# EAGLE design Motorcontroller_V0.6 (EAGLE 7.4.0)
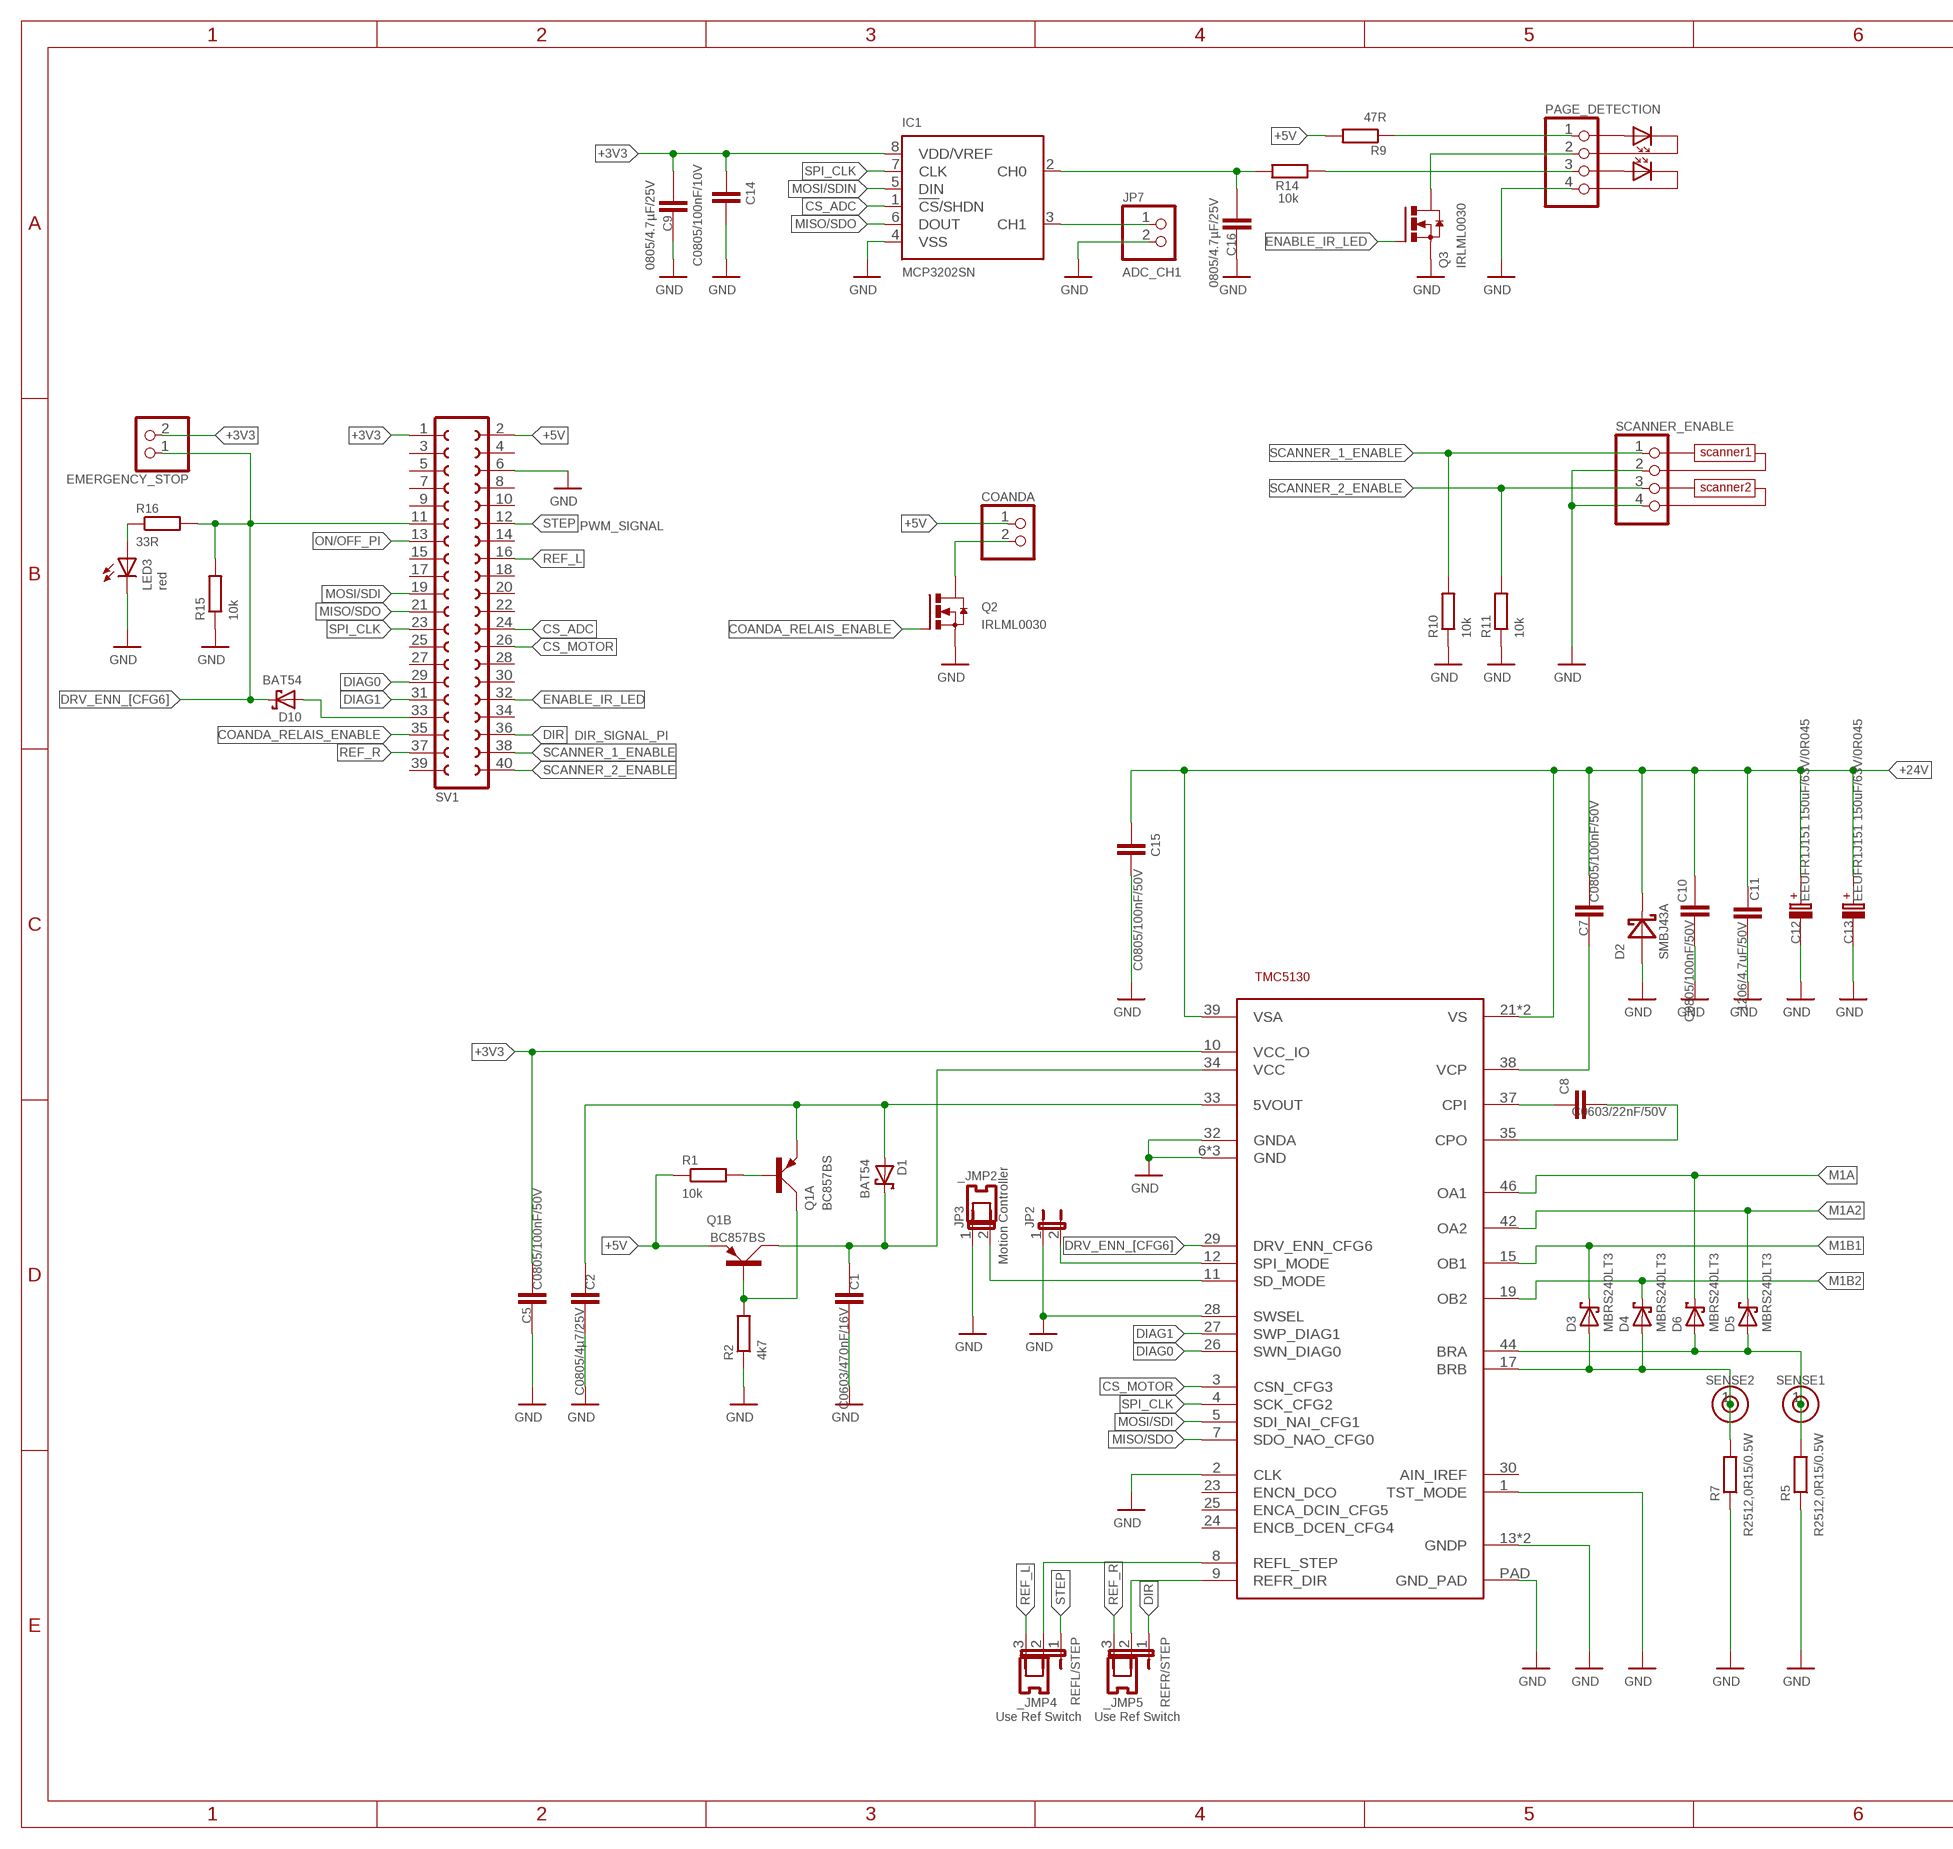
[diagram p0: schematic, sheet 1, part 1 of 2]
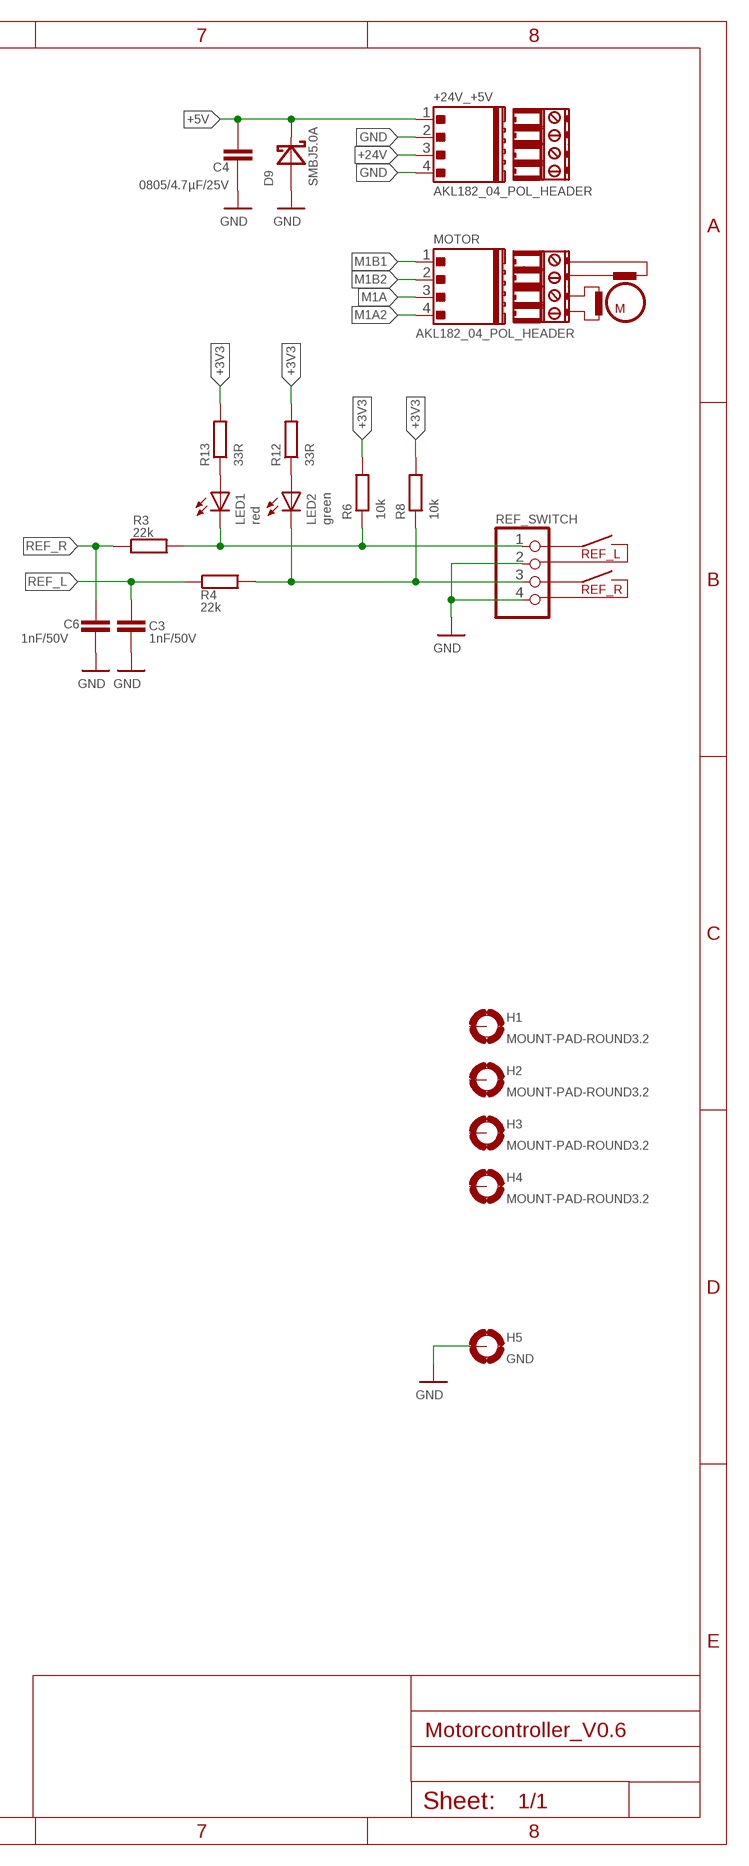
[diagram p1: schematic, sheet 1, part 2 of 2]
_JMP2 (JUMPER_2.54MM): ADGPN: 3044010200; DATASHEET: http://www.tme.eu/en/Document/d9e6fb6fc4dc34d59ba745016c42e7c7/jumper.pdf; MANUF-CODE-1: JUMPER-B; MANUFACTURER-1: Ninigi; PRICE: 0.11; SUPPLIER: TME; SUPPLIER-CODE: JUMPER-B
_JMP4 (JUMPER_2.54MM): ADGPN: 3044010200; DATASHEET: http://www.tme.eu/en/Document/d9e6fb6fc4dc34d59ba745016c42e7c7/jumper.pdf; MANUF-CODE-1: JUMPER-B; MANUFACTURER-1: Ninigi; PRICE: 0.11; SUPPLIER: TME; SUPPLIER-CODE: JUMPER-B
_JMP5 (JUMPER_2.54MM): ADGPN: 3044010200; DATASHEET: http://www.tme.eu/en/Document/d9e6fb6fc4dc34d59ba745016c42e7c7/jumper.pdf; MANUF-CODE-1: JUMPER-B; MANUFACTURER-1: Ninigi; PRICE: 0.11; SUPPLIER: TME; SUPPLIER-CODE: JUMPER-B

## Parts
+24V_+5V  AKL182_04_POL_HEADER  [AKL169_04_POL]
C1  C0603/470nF/16V  C/0603  [0603]
C2  C0805/4µ7/25V  C/0805  [0805]
C3  1nF/50V  C-EUC0603K  [C0603K]
C4  0805/4.7µF/25V  RCL_C/0805  [RCL_0805]
C5  C0805/100nF/50V  C/0805  [0805]
C6  1nF/50V  C-EUC0603K  [C0603K]
C7  C0805/100nF/50V  C/0805  [0805]
C8  C0603/22nF/50V  C-EUC0603  [C0603]
C9  0805/4.7µF/25V  RCL_C/0805  [RCL_0805]
C10  C0805/100nF/50V  C/0805  [0805]
C11  1206/4.7uF/50V  C-EUC1206  [C1206]
C12  EEUFR1J151 150uF/63V/0R045  C_POL  [C_POL_RAD_THT_5X10X12.5]
C13  EEUFR1J151 150uF/63V/0R045  C_POL  [C_POL_RAD_THT_5X10X12.5]
C14  C0805/100nF/10V  C-EUC0805  [C0805]
C15  C0805/100nF/50V  C-EUC0805  [C0805]
C16  0805/4.7µF/25V  RCL_C/0805  [RCL_0805]
COANDA  PINHD-1X2  [1X02]
D1  BAT54  [SOT23]
D2  SMBJ43A  SMBJ  [SMB]
D3  MBRS240LT3  MBRS130LT3  [SMB]
D4  MBRS240LT3  MBRS130LT3  [SMB]
D5  MBRS240LT3  MBRS130LT3  [SMB]
D6  MBRS240LT3  MBRS130LT3  [SMB]
D9  SMBJ5.0A  SMBJ  [SMB]
D10  BAT54  [SOT23]
EMERGENCY_STOP  PINHD-1X2  [1X02]
H1  MOUNT-PAD-ROUND3.2  [3,2-PAD]
H2  MOUNT-PAD-ROUND3.2  [3,2-PAD]
H3  MOUNT-PAD-ROUND3.2  [3,2-PAD]
H4  MOUNT-PAD-ROUND3.2  [3,2-PAD]
H5  GND  MOUNT-PAD-ROUND3.2  [3,2-PAD]
IC1  MCP3202SN  [SO-08]
JP2  JP1E  [JP1]
JP3  JP1E  [JP1]
JP7  ADC_CH1  PINHD-1X2  [1X02]
LED1  red  LEDCHIP-LED0805  [CHIP-LED0805]
LED2  green  LEDCHIP-LED0805  [CHIP-LED0805]
LED3  red  LEDCHIP-LED0805  [CHIP-LED0805]
MOTOR  AKL182_04_POL_HEADER  [AKL169_04_POL]
PAGE_DETECTION  PINHD-1X4  [1X04]
Q1  BC857BS  [SOT363_PHILIPS]
Q2  IRLML0030  [SOT-23]
Q3  IRLML0030  [SOT-23]
R1  10k  R-EU_M0805  [M0805]
R2  4k7  R-EU_M0805  [M0805]
R3  22k  R-EU_R0603  [R0603]
R4  22k  R-EU_R0603  [R0603]
R5  R2512,0R15/0.5W  R-EU_R2512  [R2512]
R6  10k  R-EU_M0805  [M0805]
R7  R2512,0R15/0.5W  R-EU_R2512  [R2512]
R8  10k  R-EU_M0805  [M0805]
R9  47R  R-EU_M1206  [M1206]
R10  10k  R-EU_M0805  [M0805]
R11  10k  R-EU_M0805  [M0805]
R12  33R  R-EU_M0805  [M0805]
R13  33R  R-EU_M0805  [M0805]
R14  10k  R-EU_M0805  [M0805]
R15  10k  R-EU_M0805  [M0805]
R16  33R  R-EU_M0805  [M0805]
REF_SWITCH  PINHD-1X4  [1X04]
REFL/STEP  JP2E  [JP2]
REFR/STEP  JP2E  [JP2]
SCANNER_ENABLE  PINHD-1X4  [1X04]
SENSE1  1PIN_1ROW  [1PIN_1ROW_THT]
SENSE2  1PIN_1ROW  [1PIN_1ROW_THT]
SV1  FE20-2  [FE20-2]
TERM1  AKL182_04_POL_TERMINAL  [EXTRA_TERMINAL]
TERM3  AKL182_04_POL_TERMINAL  [EXTRA_TERMINAL]
TMC5130  TMC5130  [QFP50P900X900X113-49N_NOFID]

## Nets
+3V3: C5.1 C9.1 C14.2 EMERGENCY_STOP.2 IC1.8(VDD/VREF) R6.2 R8.2 R12.2 R13.2 SV1.1 TMC5130.10(VCC_IO)
+5V: +24V_+5V.1 C4.1 COANDA.1 D9.C Q1.4(B:E) R1.1 R9.2 SV1.2
+24V: +24V_+5V.3 C7.1 C10.2 C11.1 C12.+ C13.+ C15.2 D2.C TMC5130.21(VS) TMC5130.39(VSA) TMC5130.40(VS)
COANDA_RELAIS_ENABLE: Q2.1(G) SV1.35
CS_ADC: IC1.1(!CS!/SHDN) SV1.24
CS_MOTOR: SV1.26 TMC5130.3(CSN_CFG3)
DIAG0: SV1.29 TMC5130.26(SWN_DIAG0)
DIAG1: SV1.31 TMC5130.27(SWP_DIAG1)
DIR: REFR/STEP.1 SV1.36
DRV_ENN_[CFG6]: D10.3(C) EMERGENCY_STOP.1 R15.2 R16.2 SV1.11 TMC5130.29(DRV_ENN_CFG6)
ENABLE_IR_LED: Q3.1(G) SV1.32
GND: +24V_+5V.2 +24V_+5V.4 C1.1 C2.1 C3.1 C4.2 C5.2 C6.1 C9.2 C10.1 C11.2 C12.- C13.- C14.1 C15.1 C16.2 D2.A D9.A H5.B3,2(MOUNT) IC1.4(VSS) JP2.1 JP3.1 JP7.2 LED3.C PAGE_DETECTION.4 Q2.2(S) Q3.2(S) R2.1 R5.1 R7.1 R10.1 R11.1 R15.1 REF_SWITCH.2 REF_SWITCH.4 SCANNER_ENABLE.2 SCANNER_ENABLE.4 SV1.6 TMC5130.1(TST_MODE) TMC5130.2(CLK) TMC5130.6(GND) TMC5130.13(GNDP) TMC5130.28(SWSEL) TMC5130.31(GND) TMC5130.32(GNDA) TMC5130.36(GND) TMC5130.48(GNDP) TMC5130.PAD(GND_PAD)
GND1: COANDA.2 Q2.3(D)
M1A: D6.C MOTOR.3 TMC5130.46(OA1)
M1A2: D5.C MOTOR.4 TMC5130.42(OA2)
M1B1: D3.C MOTOR.1 TMC5130.15(OB1)
M1B2: D4.C MOTOR.2 TMC5130.19(OB2)
MISO/SDO: IC1.6(DOUT) SV1.21 TMC5130.7(SDO_NAO_CFG0)
MOSI/SDI: SV1.19 TMC5130.5(SDI_NAI_CFG1)
MOSI/SDIN: IC1.5(DIN)
N$1: Q1.5(B:B) Q1.6(A:C) R2.2
N$2: C1.2 D1.3(C) Q1.3(B:C) TMC5130.34(VCC)
N$3: JP2.2 TMC5130.12(SPI_MODE)
N$4: Q1.2(A:B) R1.2
N$5: JP3.2 TMC5130.11(SD_MODE)
N$6: D10.1(A) SV1.33
N$7: LED3.A R16.1
N$8: C8.1 TMC5130.37(CPI)
N$9: C8.2 TMC5130.35(CPO)
N$10: C7.2 TMC5130.38(VCP)
N$11: PAGE_DETECTION.2 Q3.3(D)
N$12: C2.2 D1.1(A) Q1.1(A:E) TMC5130.33(5VOUT)
N$13: REFR/STEP.2 TMC5130.9(REFR_DIR)
N$14: REFL/STEP.2 TMC5130.8(REFL_STEP)
N$15: LED2.C R4.2 R8.1 REF_SWITCH.3
N$16: LED1.C R3.2 R6.1 REF_SWITCH.1
N$17: LED2.A R12.1
N$18: LED1.A R13.1
N$19: C16.1 IC1.2(CH0) R14.2
N$20: IC1.3(CH1) JP7.1
N$21: PAGE_DETECTION.3 R14.1
N$22: PAGE_DETECTION.1 R9.1
ON/OFF_PI: SV1.13
REF_L: C3.2 R4.1 REFL/STEP.3 SV1.16
REF_R: C6.2 R3.1 REFR/STEP.3 SV1.37
SCANNER_1_ENABLE: R10.2 SCANNER_ENABLE.1 SV1.38
SCANNER_2_ENABLE: R11.2 SCANNER_ENABLE.3 SV1.40
SENSE1: D5.A D6.A R5.2 SENSE1.1 TMC5130.44(BRA)
SENSE2: D3.A D4.A R7.2 SENSE2.1 TMC5130.17(BRB)
SPI_CLK: IC1.7(CLK) SV1.23 TMC5130.4(SCK_CFG2)
STEP: REFL/STEP.1 SV1.12
Unconnected: H1.B3,2(MOUNT) H2.B3,2(MOUNT) H3.B3,2(MOUNT) H4.B3,2(MOUNT) SV1.3 SV1.4 SV1.5 SV1.7 SV1.8 SV1.9 SV1.10 SV1.14 SV1.15 SV1.17 SV1.18 SV1.20 SV1.22 SV1.25 SV1.27 SV1.28 SV1.30 SV1.34 SV1.39 TMC5130.23(ENCN_DCO) TMC5130.24(ENCB_DCEN_CFG4) TMC5130.25(ENCA_DCIN_CFG5) TMC5130.30(AIN_IREF)

## Notes on the sheet
- M
- scanner1
- scanner2
- PWM_SIGNAL
- REF_L
- REF_R
- DIR_SIGNAL_PI

## Library data of the parts
+24V_+5V MOTOR = _TMC_TE_con:AKL182_04_POL_HEADER: AKL header, shrouted, 4 pins; 1_PARTNUMBER: 31182104; 1_SUPPLIER: RIA CONNECT; 2_PARTNUMBER: AKL 182-04; 2_SUPPLIER: Reichelt
C1 C2 C5 C7 C10 = _TMC_TE_RCL:C
C3 C6 C8 C11 C14 C15 = rcl:C-EU: CAPACITOR, European symbol
C4 C9 C16 = TMC_EVAL_driver_TE_v01:RCL_C
C12 C13 = _TMC_TE_RCL:C_POL
COANDA EMERGENCY_STOP JP7 = pinhead:PINHD-1X2: PIN HEADER
D1 D10 = diode:BAT54: Schottky Diodes Source: Fairchild .. BAT54.pdf
D2 D9 = _TMC_TE_D:SMBJ
D3-D6 = diode:MBRS130LT3: Schottky Power Rectifier Source: http://www.onsemi.com/pub/Collateral/MBRS130LT3-D.PDF
H1-H5 = holes:MOUNT-PAD-ROUND: MOUNTING PAD, round
IC1 = microchip:MCP3202: 2.7V Dual Channel 12-Bit A/D Converter with SPI Serial Interface Source: http://ww1.microchip.com/downloads/en/DeviceDoc/21034D.pdf; MF: MICROCHIP; MPN: MCP3202-CI/SN; OC_FARNELL: 1196803; OC_NEWARK: 19C7207
JP2 JP3 = jumper:JP1E: JUMPER
LED1-LED3 = led:LED: LED OSRAM: - CHIPLED LG R971, LG N971, LY N971, LG Q971, LY Q971, LO R971, LY R971 LH N974, LH R974 LS Q976, LO Q976, LY Q976 LO Q996 - Hyper CHIPLED LW Q18S LB Q993, LB Q99A, LB R99A - SideLED LS A670, LO A670, LY A670, LG A670, LP A670 LB A673, LV A673, LT A673, LW A673 LH A674 LY A675 LS A676, LA A676, LO A676, LY A676, LW A676 LS A679, LY A679, LG A679 - Hyper Micro SIDELED® LS Y876, LA Y876, LO Y876, LY Y876 LT Y87S - SmartLED LW L88C, LW L88S LB L89C, LB L89S, LG L890 LS L89K, LO L89K, LY L89K LS L896, LA L896, LO L896, LY L896 - TOPLED LS T670, LO T670, LY T670, LG T670, LP T670 LSG T670, LSP T670, LSY T670, LOP T670, LYG T670 LG T671, LOG T671, LSG T671 LB T673, LV T673, LT T673, LW T673 LH T674 LS T676, LA T676, LO T676, LY T676, LB T676, LH T676, LSB T676, LW T676 LB T67C, LV T67C, LT T67C, LS T67K, LO T67K, LY T67K, LW E67C LS E67B, LA E67B, LO E67B, LY E67B, LB E67C, LV E67C, LT E67C LW T67C LS T679, LY T679, LG T679 LS T770, LO T770, LY T770, LG T770, LP T770 LB T773, LV T773, LT T773, LW T773 LH T774 LS E675, LA E675, LY E675, LS T675 LS T776, LA T776, LO T776, LY T776, LB T776 LHGB T686 LT T68C, LB T68C - Hyper Mini TOPLED® LB M676 - Mini TOPLED Santana® LG M470 LS M47K, LO M47K, LY M47K Source: http://www.osram.convergy.de LUXEON: - LUMILED® LXK2-PW12-R00, LXK2-PW12-S00, LXK2-PW14-U00, LXK2-PW14-V00 LXK2-PM12-R00, LXK2-PM12-S00, LXK2-PM14-U00 LXK2-PE12-Q00, LXK2-PE12-R00, LXK2-PE12-S00, LXK2-PE14-T00, LXK2-PE14-U00 LXK2-PB12-K00, LXK2-PB12-L00, LXK2-PB12-M00, LXK2-PB14-N00, LXK2-PB14-P00, LXK2-PB14-Q00 LXK2-PR12-L00, LXK2-PR12-M00, LXK2-PR14-Q00, LXK2-PR14-R00 LXK2-PD12-Q00, LXK2-PD12-R00, LXK2-PD12-S00 LXK2-PH12-R00, LXK2-PH12-S00 LXK2-PL12-P00, LXK2-PL12-Q00, LXK2-PL12-R00 Source: www.luxeon.com KINGBRIGHT: KA-3528ASYC Source: www.kingbright.com
PAGE_DETECTION REF_SWITCH SCANNER_ENABLE = pinhead:PINHD-1X4: PIN HEADER
Q1 = transistor-small-signal:BC857BS
Q2 Q3 = transistor-power:IRLML0030
R1-R16 = rcl:R-EU_: RESISTOR, European symbol
REFL/STEP REFR/STEP = jumper:JP2E: JUMPER
SENSE1 SENSE2 = _TMC_TE_con:1PIN_1ROW
SV1 = con-lsta:FE20-2: FEMALE HEADER; OC_FARNELL: unknown; OC_NEWARK: unknown
TERM1 TERM3 = _TMC_TE_con:AKL182_04_POL_TERMINAL: AKL terminal, 4 pins; 1_PARTNUMBER: 31169104; 1_SUPPLIER: RIA CONNECT; 2_PARTNUMBER: AKL 169-04; 2_SUPPLIER: Reichelt
TMC5130 = Trinamic:TMC5130; OC_DIGIKEY: _

## Net classes
0 default: width 0.254 mm, drill 0.15 mm

## Board
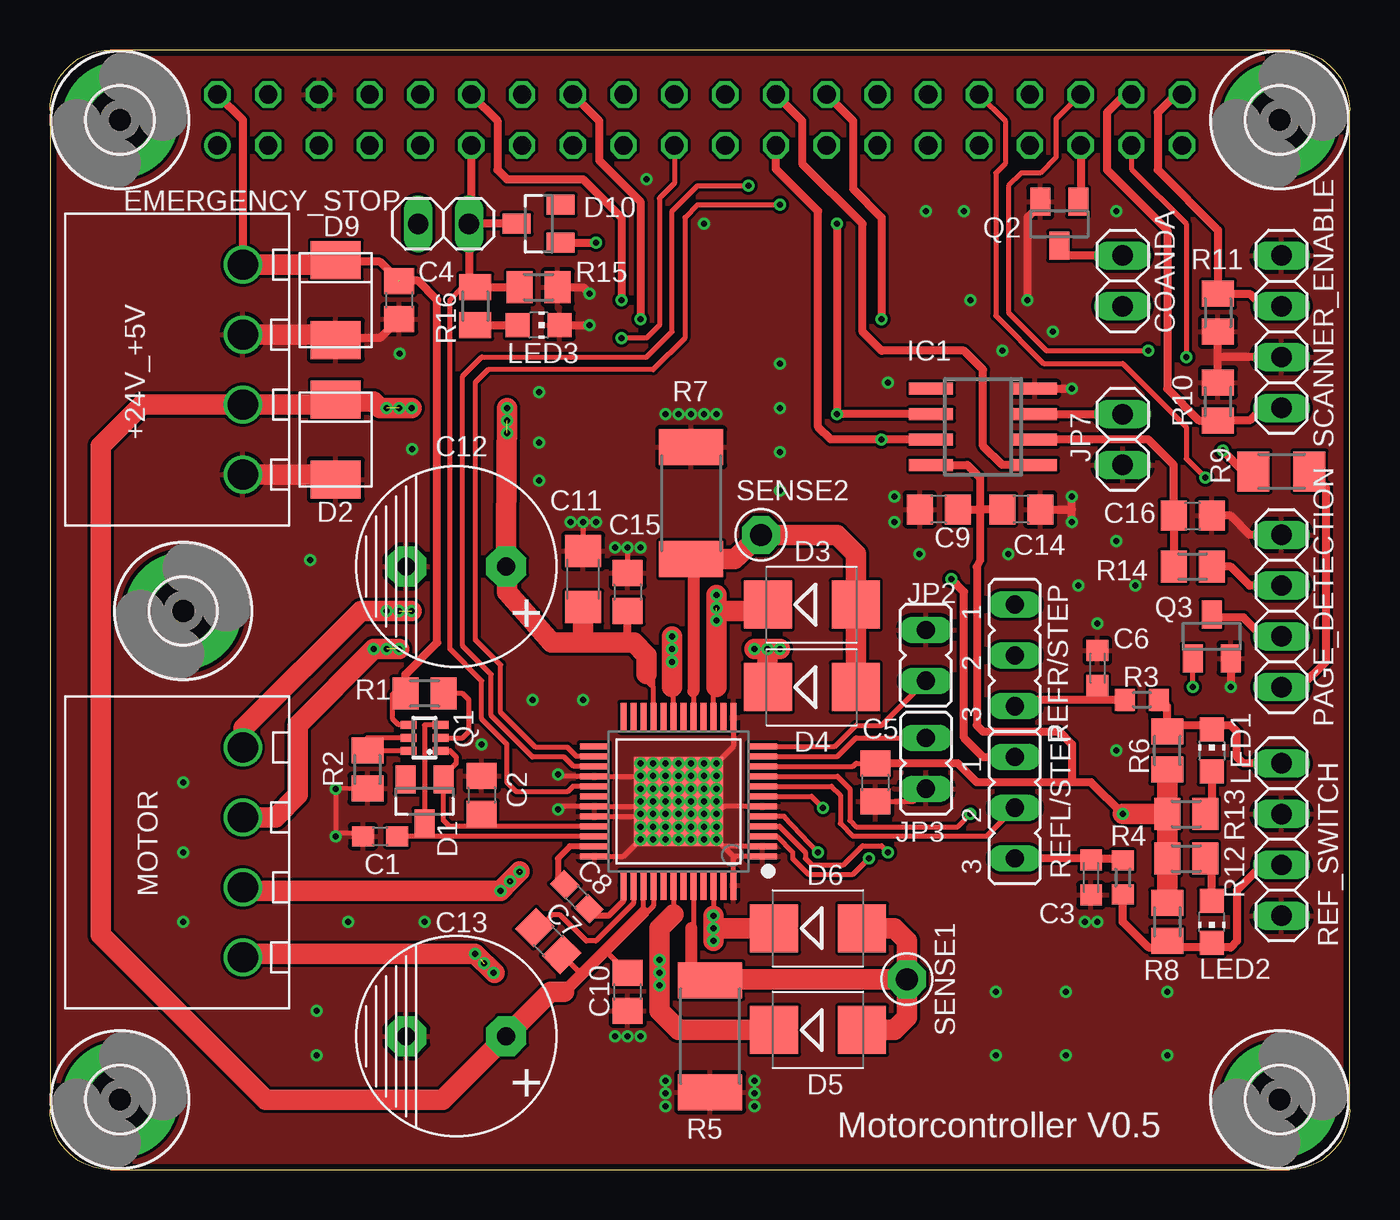
[diagram p2: board, top side]
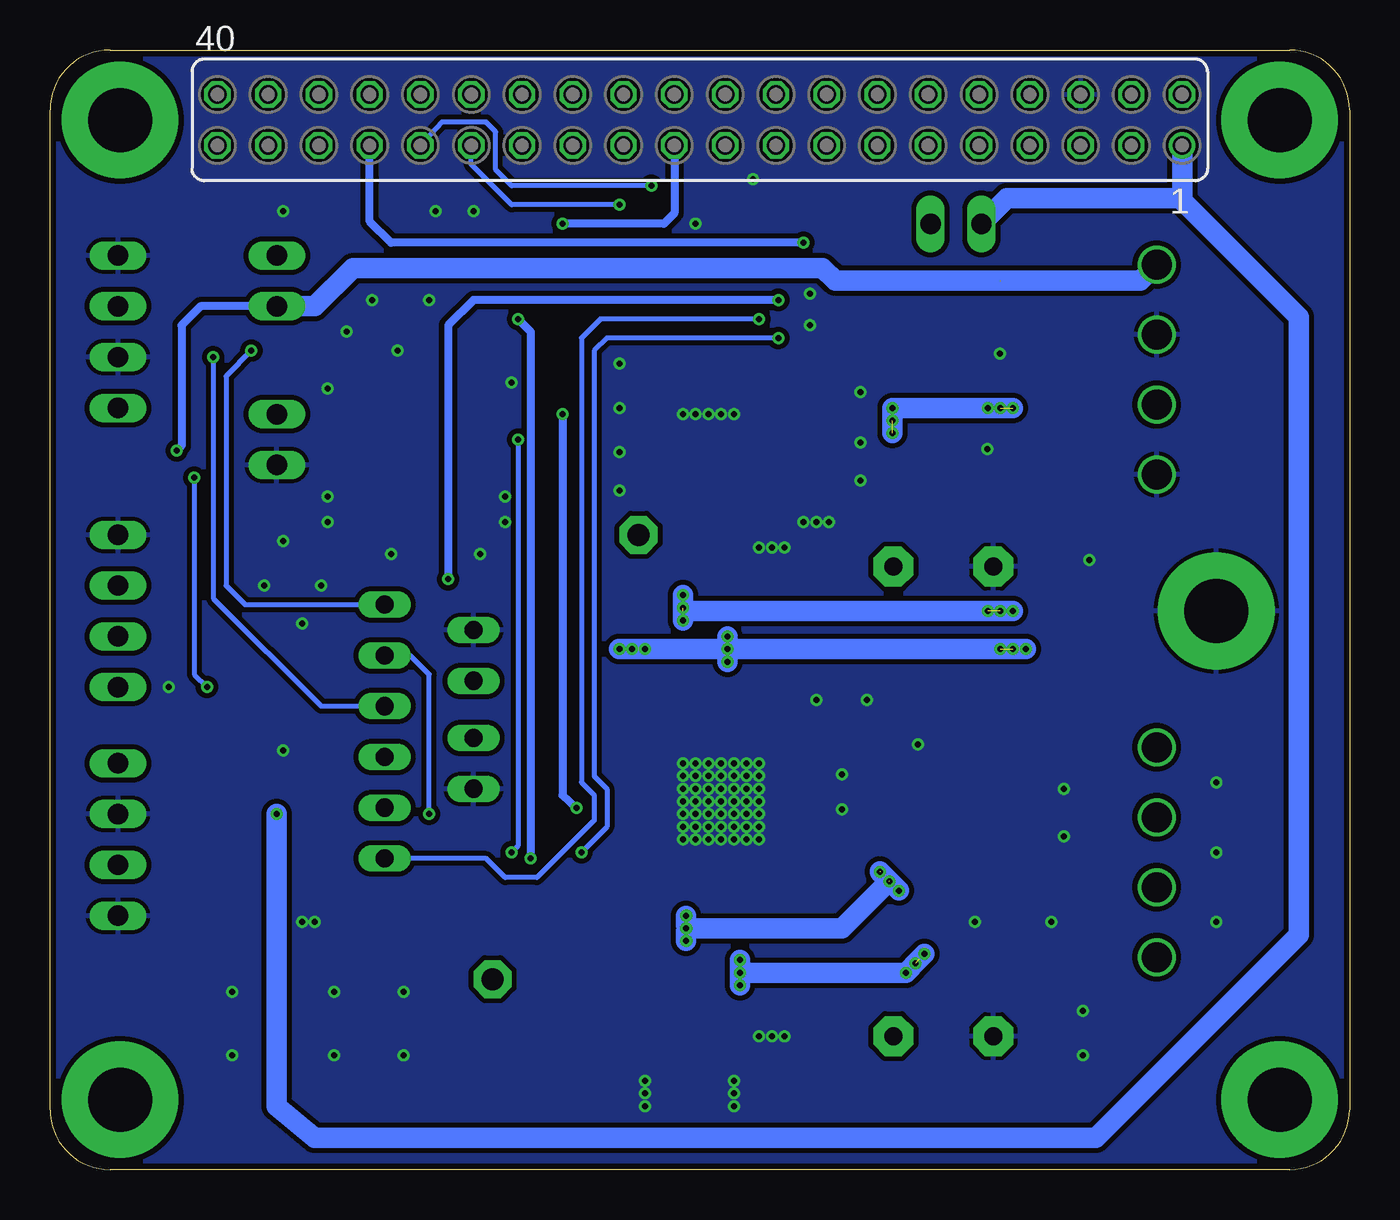
[diagram p3: board, bottom side, seen from below]

Size 65 x 56 mm. Coordinates in mm from the lower left corner, seen from the top.
Outline: 3,0 62,0 arc90 65,3 65,53 arc90 62,56 3,56 arc90 0,53 0,3 arc90 3,0
Copper layers (1*16): Top 0.035mm / dielectric 1.5mm / Bottom 0.035mm
Design rules "PCB-POOL Standard": minimum track width 0.15mm, minimum drill 0.3mm, track to track 0.15mm, track to pad 0.15mm, pad to pad 0.15mm, via to via 0.15mm, smd to smd 0.15mm, copper to edge 0.3mm, drill to drill 0.2mm, minimum pad ring 0.2mm, minimum via ring 0.15mm, stop-mask expansion 0.075mm, vias tented up to drill 0mil, thermal gap 0.2mm

### Footprints (pad centres in the part's own frame; a part is rotated, then mirrored left to right if it is on the bottom)
AKL169_04_POL = drill 1.5: 1 -5.25,3.3; 2 -1.75,3.3; 3 1.75,3.3; 4 5.25,3.3
0603 = smd 1.1 x 1: 1 -0.85,0; 2 0.85,0
0805 = smd 1.3 x 1.5: 1 -0.95,0; 2 0.95,0
C0603K = smd 1.05 x 1.08: 1 -0.875,0; 2 0.875,0
RCL_0805 = smd 1.3 x 1.5: 1 -0.95,0; 2 0.95,0
C0603 = smd 1.1 x 1: 1 -0.85,0; 2 0.85,0
C1206 = smd 1.6 x 1.8: 1 -1.4,0; 2 1.4,0
C_POL_RAD_THT_5X10X12.5 = drill 0.9 pad 2 octagon: + 2.5,0; - -2.5,0
C0805 = smd 1.3 x 1.5: 1 -0.95,0; 2 0.95,0
1X02 = drill 1.016 long: 1 -1.27,0; 2 1.27,0
SOT23 = smd 1 x 1.4: 1 -0.95,-1.1; 2 0.95,-1.1; 3 0,1.1
SMB = smd 1.9 x 2.5: A 2,0; C -2,0
SMB' = smd 2.4 x 2.4: A 2.2,0; C -2.2,0
3,2-PAD = drill 3.2 pad 5.842: B3,2 0,0
SO-08 = smd 0.6 x 2.2: 1 -1.905,-2.6; 2 -0.635,-2.6; 3 0.635,-2.6; 4 1.905,-2.6; 5 1.905,2.6; 6 0.635,2.6; 7 -0.635,2.6; 8 -1.905,2.6
JP1 = drill 0.914 long: 1 0,-1.27; 2 0,1.27
CHIP-LED0805 = smd 1.2 x 1.2: A 0,-1.05; C 0,1.05
1X04 = drill 1.016 long: 1 -3.81,0; 2 -1.27,0; 3 1.27,0; 4 3.81,0
SOT363_PHILIPS = smd 0.4 x 0.8: 1 -0.65,-0.8; 2 0,-0.8; 3 0.65,-0.8; 4 0.65,0.8; 5 0,0.8; 6 -0.65,0.8
SOT-23 = smd 1 x 1.4: 1 -0.95,-1.1; 2 0.95,-1.1; 3 0,1.1
M0805 = smd 1.3 x 1.6: 1 -0.95,0; 2 0.95,0
R0603 = smd 1 x 1.1: 1 -0.85,0; 2 0.85,0
R2512 = smd 1.8 x 3.2: 1 -2.8,0; 2 2.8,0
M1206 = smd 1.6 x 2: 1 -1.4,0; 2 1.4,0
JP2 = drill 0.914 long: 1 -2.54,0; 2 0,0; 3 2.54,0
1PIN_1ROW_THT = drill 1.1 pad 1.9 octagon: 1 0,0
FE20-2 = drill 0.914: 1 -24.13,1.27 | drill 0.914 octagon: 2 -24.13,-1.27; 3 -21.59,1.27; 4 -21.59,-1.27; 5 -19.05,1.27; 6 -19.05,-1.27; 7 -16.51,1.27; 8 -16.51,-1.27; 9 -13.97,1.27; 10 -13.97,-1.27; 11 -11.43,1.27; 12 -11.43,-1.27; 13 -8.89,1.27; 14 -8.89,-1.27; 15 -6.35,1.27; 16 -6.35,-1.27; 17 -3.81,1.27; 18 -3.81,-1.27; 19 -1.27,1.27; 20 -1.27,-1.27; 21 1.27,1.27; 22 1.27,-1.27; 23 3.81,1.27; 24 3.81,-1.27; 25 6.35,1.27; 26 6.35,-1.27; 27 8.89,1.27; 28 8.89,-1.27; 29 11.43,1.27; 30 11.43,-1.27; 31 13.97,1.27; 32 13.97,-1.27; 33 16.51,1.27; 34 16.51,-1.27; 35 19.05,1.27; 36 19.05,-1.27; 37 21.59,1.27; 38 21.59,-1.27; 39 24.13,1.27; 40 24.13,-1.27
QFP50P900X900X113-49N_NOFID = smd 1.45 x 0.3: 1 -4.2,2.75; 2 -4.2,2.25; 3 -4.2,1.75; 4 -4.2,1.25; 5 -4.2,0.75; 6 -4.2,0.25; 7 -4.2,-0.25; 8 -4.2,-0.75; 9 -4.2,-1.25; 10 -4.2,-1.75; 11 -4.2,-2.25; 12 -4.2,-2.75; 25 4.2,-2.75; 26 4.2,-2.25; 27 4.2,-1.75; 28 4.2,-1.25; 29 4.2,-0.75; 30 4.2,-0.25; 31 4.2,0.25; 32 4.2,0.75; 33 4.2,1.25; 34 4.2,1.75; 35 4.2,2.25; 36 4.2,2.75 | smd 0.3 x 1.45: 13 -2.75,-4.2; 14 -2.25,-4.2; 15 -1.75,-4.2; 16 -1.25,-4.2; 17 -0.75,-4.2; 18 -0.25,-4.2; 19 0.25,-4.2; 20 0.75,-4.2; 21 1.25,-4.2; 22 1.75,-4.2; 23 2.25,-4.2; 24 2.75,-4.2; 37 2.75,4.2; 38 2.25,4.2; 39 1.75,4.2; 40 1.25,4.2; 41 0.75,4.2; 42 0.25,4.2; 43 -0.25,4.2; 44 -0.75,4.2; 45 -1.25,4.2; 46 -1.75,4.2; 47 -2.25,4.2; 48 -2.75,4.2 | smd 4.45 x 4.45: PAD 0,0

### Placement (x,y rotation side)
+24V_+5V  6.35,40.01 270 top
C1  16.51,16.67 0 top
C2  21.59,18.73 270 top
C3  52.07,14.61 90 top
C4  17.46,43.5 270 top
C5  41.27,19.37 270 top
C6  52.39,25.08 270 top
C7  24.92,11.43 135 top
C8  26.35,13.65 135 top
C9  44.45,33.02 180 top
C10  28.89,8.89 90 top
C11  26.67,29.53 90 top
C12  20.32,30.16 0 top
C13  20.32,6.67 0 top
C14  48.58,33.02 180 top
C15  28.89,28.89 270 top
C16  57.15,32.7 0 top
COANDA  53.66,44.45 90 top
D1  18.73,18.41 180 top
D2  14.29,36.51 270 top
D3  MBRS240LT3  [SMB']  38.1,28.26 0 top
D4  MBRS240LT3  [SMB']  38.1,24.13 0 top
D5  MBRS240LT3  [SMB']  38.42,6.99 0 top
D6  MBRS240LT3  [SMB']  38.42,12.06 0 top
D9  14.29,43.5 270 top
D10  24.45,47.31 90 top
EMERGENCY_STOP  19.68,47.31 180 top
H1  61.5,3.5 0 top
H2  3.5,3.5 0 top
H3  61.5,52.5 0 top
H4  3.5,52.5 0 top
H5  6.67,27.94 0 top
IC1  46.67,37.15 90 top
JP2  43.81,25.72 180 top
JP3  43.81,20.32 0 top
JP7  53.66,36.51 270 top
LED1  58.1,20.95 0 top
LED2  58.1,12.38 180 top
LED3  24.45,42.23 270 top
MOTOR  6.35,15.88 270 top
PAGE_DETECTION  61.59,27.94 90 top
Q1  18.73,21.59 90 top
Q2  50.48,47.31 180 top
Q3  58.1,26.67 0 top
R1  18.73,23.81 0 top
R2  15.88,20 90 top
R3  54.61,23.5 0 top
R4  53.66,14.61 270 top
R5  33.02,6.67 90 top
R6  55.88,20.95 270 top
R7  32.07,33.34 270 top
R8  55.88,12.38 90 top
R9  61.59,34.92 180 top
R10  58.42,38.42 270 top
R11  58.42,42.86 90 top
R12  56.83,15.56 180 top
R13  56.83,17.78 180 top
R14  57.15,30.16 180 top
R15  24.45,44.13 180 top
R16  21.27,43.18 90 top
REF_SWITCH  61.59,16.51 270 top
REFL/STEP  48.26,18.1 270 top
REFR/STEP  48.26,25.72 270 top
SCANNER_ENABLE  61.59,41.91 90 top
SENSE1  42.86,9.53 270 top
SENSE2  35.56,31.75 270 top
SV1  32.5,52.5 180 bottom
TERM1  49.85,60.96 0 top  (outside the outline)
TERM3  44.77,60.33 0 top  (outside the outline)
TMC5130  31.43,18.41 180 top

### Tracks (layer width: path | path; a pad name or v marks a point on that pad's centre or on a via)
+3V3  (via drill 0.3)
  Top 0.254: TMC5130.10 40.17,20.16 40.32,20.32 40.33,20.32 C5.1
  Top 0.406: IC1.8 45.88,35.24 46.51,34.61 46.51,33.02 | C14.2 46.51,33.02 | 40.96,20.64 C5.1 45.4,20.32 46.35,19.37 51.12,19.37 | v53.66,17.78 52.07,19.37 51.12,19.37 | C9.1 46.51,33.02 | 46.51,33.02 46.51,30.48 46.35,30.16 46.35,22.23 46.67,21.91 50.48,21.91 51.12,21.27 51.12,19.37
  Top 1.016: R6.2 R13.2 R12.2 R8.2 R13.2 v53.66,17.78
  Bottom 1.016: SV1.1 8.37,48.46 | EMERGENCY_STOP.2 17.14,48.58 8.48,48.58 8.37,48.46 | v53.66,17.78 53.66,3.17 51.75,1.59 12.7,1.59 2.54,11.75 2.54,42.63 8.37,48.46
+5V  (via drill 0.3)  (1 unrouted)
  Top 0.254: 14.38,45.4 D9.C | Q1.4 17.45,22.24 17.14,22.54 17.14,23.81 R1.1
  Top 0.406: C4.1 16.51,45.4 14.38,45.4 | +24V_+5V.1 9.65,52.49 SV1.2 | R1.1 17.78,24.77 19.37,26.35 19.37,43.5 18.41,44.45 C4.1 | v58.66,35.96 59.69,34.92 R9.2
  Top 1.016: +24V_+5V.1 14.29,45.26 D9.C
  Bottom 0.406: COANDA.1 57.47,43.18 58.42,42.23 58.42,36.2 v58.66,35.96
  Bottom 1.016: COANDA.1 51.75,43.18 49.85,45.09 26.35,45.09 25.72,44.45 10.46,44.45 +24V_+5V.1
+24V  (via drill 0.3)  (2 unrouted)
  Top 0.254: TMC5130.40 30.18,13.2 29.69,12.7 29.69,12.86 TMC5130.39 | C10.2 27.94,10.79 27.62,10.79 | TMC5130.21 30.18,24.13 29.84,24.45 29.84,24.79 | 28.57,26.35 28.89,26.35 | C7.1 26.51,9.84 26.67,9.84
  Top 0.406: 28.89,26.35 C15.2
  Top 0.61: 29.69,12.86 27.62,10.79 26.67,9.84 25.72,8.89
  Top 1.016: 26.67,26.35 28.57,26.35 29.21,26.35 29.84,25.72 29.84,24.79 | C11.1 26.67,26.35 | 26.67,26.35 25.08,26.35 22.86,28.89 22.86,30.12 C12.+ 22.82,31.79 v22.86,38.1 | v18.1,38.1 16.51,38.1 16.19,38.42 14.38,38.42 D2.C 13.97,38.26 +24V_+5V.3 4.6,38.26 2.54,36.2 2.54,11.75 10.79,3.49 19.64,3.49 C13.+ 25.04,8.89 25.72,8.89
  Bottom 1.016: v16.83,38.1 v18.1,38.1 v22.86,38.1 v22.86,36.83
  other vias: 17.46,38.1 22.86,37.47
COANDA_RELAIS_ENABLE
  Top 0.406: SV1.35 51.55,48.52 Q2.1
CS_ADC
  Top 0.406: IC1.1 47.62,35.24 46.67,36.2 46.67,40.01 45.72,40.96 41.59,40.96 40.64,41.91 40.64,47.31 37.62,50.32 37.62,52.46 SV1.24
CS_MOTOR  (via drill 0.3)
  Top 0.254: v40.96,15.56 40.16,14.76 37.94,14.76 37.15,15.56 37.15,15.88 36.36,16.66 TMC5130.3
  Top 0.406: SV1.26 40.16,52.46 40.16,49.05 41.59,47.62 v41.59,42.55
  Bottom 0.406: v41.59,42.55 40.96,41.91 v40.96,15.56
DIAG0  (via drill 0.3)
  Top 0.254: TMC5130.26 26.32,20.66 25.88,21.11 24.29,21.11 22.54,22.86 22.54,25.24 21.27,26.51 21.27,39.37 21.91,40.01 30.16,40.01 31.75,41.59 31.75,47.62 32.38,48.26 v36.51,48.26
  Bottom 0.254: v36.51,48.26 41.91,48.26 43.93,50.28 SV1.29
DIAG1  (via drill 0.3)
  Top 0.254: TMC5130.27 26.19,20.16 25.72,20.64 24.13,20.64 22.07,22.7 22.07,24.77 20.64,26.19 20.64,39.69 21.59,40.64 29.84,40.64 31.11,41.91 31.11,47.94 32.38,49.21 v34.92,49.21
  Bottom 0.254: v34.92,49.21 41.91,49.21 42.7,50.01 42.7,51.91 43.18,52.39 45.41,52.39 SV1.31
DIR  (via drill 0.3)
  Top 0.254: SV1.36 50.32,52.55 50.32,50.64 49.53,49.85 48.58,49.85 47.94,49.21 47.94,42.86 49.85,40.96 v54.93,40.96
  Bottom 0.254: v54.93,40.96 56.2,39.69 56.2,29.21 55.24,28.26 REFR/STEP.1
DRV_ENN_[CFG6]
  Top 0.254: TMC5130.29 26.15,19.16 25.88,18.89 23.34,18.89 22.86,19.37 22.86,21.27 21.59,22.54 21.59,24.45 20,26.04 20,43.5 20.64,44.13 20.95,44.13 21.91,44.13 R16.2 | R15.2
  Top 0.406: R16.2 R15.2 | SV1.11 21.07,47.42 EMERGENCY_STOP.1 | D10.3 EMERGENCY_STOP.1 | EMERGENCY_STOP.1 20.95,44.13
ENABLE_IR_LED  (via drill 0.3)
  Top 0.254: SV1.32 47.78,52.46 47.78,50.32 47.31,49.85 47.31,42.7 49.69,40.32 53.66,40.32 56.83,37.15 56.83,35.56 v57.78,34.61 | v57.15,24.13 Q3.1
  Bottom 0.254: v57.78,34.61 57.78,24.77 v57.15,24.13
GND  (via drill 0.3)
  Top 0.254: R2.1 v14.29,19.05 14.29,16.83 15.88,16.83 15.88,16.88 C1.1 | 14.51,41.27 D9.A 14.38,41.59 | C4.2 | C5.2 43.18,18.42 JP3.1 | 25.42,19.66 v25.4,19.76 25.48,19.68 27.3,19.68 | v25.4,18.02 25.47,18.16 TMC5130.31 31.18,18.16 TMC5130.PAD | TMC5130.13 34.18,21.16 v33.34,20.32 | TMC5130.6 33.72,18.16 v33.34,17.78 | TMC5130.32 29.41,17.66 v29.53,17.78 | TMC5130.36 28.68,15.66 v29.53,16.51 | TMC5130.48 34.18,15.56 | 34.18,15.56 34.18,15.66 33.68,16.16 | TMC5130.1 34.29,15.66 34.18,15.56 | TMC5130.2 33.68,16.16 | 33.68,16.16 v33.34,16.51 | TMC5130.28 30.18,19.66 v30.8,19.05 | v27.3,32.38 v26.67,32.38 26.67,30.8 | v28.89,31.11 C15.1
  Top 0.406: C4.2 16.51,41.59 14.38,41.59 | SCANNER_ENABLE.2 58.42,40.64 | R10.1 58.42,40.64 | 58.42,40.64 R11.1 | PAGE_DETECTION.4 60.01,31.75 59.05,32.7 C16.2 | Q3.2 v59.05,24.13 | Q2.2 49.53,48.26 48.9,47.62 v48.9,43.5 | IC1.4 v51.12,39.05 | C14.1 51.12,33.02 | 51.12,33.02 v51.12,33.66 | v51.12,32.38 51.12,33.02 | LED3.C v26.99,42.23 | R15.1 26.67,44.13 v26.99,43.81
  Top 1.016: D9.A 14.29,41.76 +24V_+5V.2 | D2.A 14.29,34.76 +24V_+5V.4
  other vias: 52.39,12.38 21.59,21.27 29.53,20.32 30.8,20.32 32.07,20.32 33.34,19.05 32.07,19.05 29.53,19.05 30.8,17.78 32.07,17.78 32.07,16.51 30.8,16.51 30.8,4.45 30.8,3.17 35.24,4.45 32.07,37.78 30.8,37.78 33.34,37.78 26.04,32.38 35.24,3.17 28.26,6.67 29.53,6.67 42.23,33.66 42.23,32.38 52.39,27.3 53.34,31.43 36.51,40.32 46.04,43.5 47.62,40.96 43.81,47.94 45.72,47.94 55.88,8.89 55.88,5.71 50.8,8.89 50.8,5.71 47.31,5.71 47.31,8.89 13.34,7.94 13.34,5.71 6.67,19.37 6.67,15.88 6.67,12.38 14.92,12.38 18.73,12.38 24.13,23.5 26.67,23.5 13.02,30.48 17.48,40.8 18.11,36.04 24.46,38.9 24.46,36.36 24.46,34.45 32.7,47.31 29.84,49.53 53.34,20.95 36.51,35.88 36.51,33.97 36.51,38.1 41.91,39.37 43.5,30.8 47.94,30.8 51.44,29.21 54.29,29.21 50.16,41.91 53.34,47.94 14.29,16.67 31.43,37.78 32.7,37.78 28.89,6.67 30.8,3.81 35.24,3.81 30.16,20.32 31.43,20.32 32.7,20.32 29.53,19.68 30.16,19.68 30.8,19.68 31.43,19.68 32.07,19.68 32.7,19.68 33.34,19.68 32.7,19.05 31.43,19.05 30.16,19.05 29.53,18.41 30.16,18.41 30.8,18.41 31.43,18.41 32.07,18.41 32.7,18.41 33.34,18.41 32.7,17.78 51.75,12.38 31.43,17.78 30.16,17.78 29.53,17.14 30.16,17.14 30.8,17.14 31.43,17.14 32.07,17.14 32.7,17.14 33.34,17.14 32.7,16.51 31.43,16.51 30.16,16.51 29.53,31.11 28.26,31.11
  pour Bottom (isolate 0.254): 0,0 65,0 65,56 0,56
  pour Top: 0,0 65,0 65,56 0,56
  pour Top (no thermals): 28.57,21.27 28.57,15.56 34.29,15.56 34.29,21.27
GND1
  Top 0.406: COANDA.2 50.97,45.72 Q2.3
M1A  (via drill 0.3, 0.3 pad 0.61)  (2 unrouted)
  Top 0.254: TMC5130.46 v33.18,12.7 33.18,13.02
  Top 1.016: v33.18,11.43 v33.18,12.06 | v33.18,12.06 v33.18,12.7 | D6.C v33.18,12.06 | 23.5,14.92 22.7,14.12 22.7,14.09 v22.54,13.93 9.84,13.93 MOTOR.3
  Bottom 1.016: 33.02,12.06 25.4,12.06 23.02,14.45 23.06,14.45 v23.5,14.88 | 33.02,12.06 33.18,12.22 v33.18,12.7 | 33.02,12.06 33.18,11.91 v33.18,11.43
  other vias: 23.02,14.41
M1A2  (via drill 0.3, 0.3 pad 0.61)  (1 unrouted)
  Top 0.254: TMC5130.42 31.18,12.77
  Top 1.016: 31.18,12.77 30.48,12.06 v30.48,10.48 30.48,7.94 31.43,6.99 D5.C | MOTOR.4 9.85,10.78 v21.27,10.79 22.23,9.84
  Bottom 1.016: v21.27,10.79 21.55,10.52 v22.18,9.84 v30.48,9.84 v30.48,10.48 v30.48,9.21
  other vias: 21.7,10.32
M1B1  (via drill 0.3, 0.3 pad 0.61)  (2 unrouted)
  Top 0.254: TMC5130.15 33.18,23.98 33.34,24.13
  Top 1.016: 33.34,24.13 v33.34,27.46 33.34,27.94 | v33.34,28.73 33.34,27.94 | 33.34,27.94 35.9,27.94 D3.C | MOTOR.1 9.7,22.08 15.56,27.94 v16.83,27.94 v18.1,27.94
  Bottom 1.016: v16.83,27.94 33.34,27.94 | v33.34,28.73 33.34,27.94 | v33.34,27.46 33.34,27.94
  other vias: 17.46,27.94 33.34,28.1
M1B2  (via drill 0.3, 0.3 pad 0.61)  (1 unrouted)
  Top 0.254: TMC5130.19 31.18,24.38 31.11,24.45
  Top 1.016: 31.11,24.13 31.11,24.45 v31.11,25.4 v31.11,26.67 | 35.9,24.77 D4.C 35.88,24.13 v35.88,26.04 | v35.88,26.04 v35.24,26.04 | v35.88,26.04 v36.51,26.04 | MOTOR.2 11.28,17.62 12.38,18.73 12.38,22.23 v16.19,26.04 v17.46,26.04
  Bottom 1.016: v16.19,26.04 v31.11,26.04 | v31.11,26.67 v31.11,26.04 | v31.11,25.4 v31.11,26.04 | 36.53,26.04 v36.51,26.04 v35.24,26.04 v31.11,26.04
  other vias: 16.83,26.04
MISO/SDO  (via drill 0.3)
  Top 0.254: TMC5130.7 38.09,18.66 v38.66,18.1
  Top 0.406: IC1.6 v39.37,37.78 v39.37,47.31
  Bottom 0.406: SV1.21 33.77,47.83 34.29,47.31 v39.37,47.31 | v39.37,37.78 39.37,18.73 v38.66,18.1
MOSI/SDI  (via drill 0.3)
  Top 0.254: SV1.19 31.23,49.33 30.48,48.58 30.48,42.23 29.84,41.59 v28.57,41.59 | v38.42,15.88 36.72,17.66 TMC5130.5
  Bottom 0.254: v28.57,41.59 37.15,41.59 37.78,40.96 37.78,19.68 37.15,19.05 37.15,17.14 v38.42,15.88
N$1
  Top 0.254: Q1.5 15.88,21.59 R2.2 Q1.6
N$2
  Top 0.254: Q1.3 18.75,22.24 18.73,22.23 D1.3 18.73,16.66 | TMC5130.34 18.73,16.66 | 18.73,16.66 17.2,16.66 C1.2
N$3
  Top 0.254: TMC5130.12 39.26,21.16 40.32,22.23 41.59,22.23 JP2.2
N$4
  Top 0.254: Q1.2 20.64,21.59 20.95,21.91 20.95,23.5 20.64,23.81 R1.2
N$5
  Top 0.254: TMC5130.11 39.4,20.66 40.32,21.59 JP3.2
N$6  (via drill 0.3)
  Top 0.406: D10.1 v27.3,46.36 v27.3,46.35
  Bottom 0.406: v27.3,46.35 47.94,46.35 49.01,47.42 SV1.33
N$7
  Top 0.406: R16.1 LED3.A
N$8
  Top 0.305: TMC5130.37 28.68,13.44 27.94,12.7 27.3,12.7 C8.1
N$9
  Top 0.305: TMC5130.35 26.01,16.16 25.4,15.56 25.4,14.61 C8.2
N$10
  Top 0.254: TMC5130.38 29.18,13.31 27.3,11.43 26.83,11.43 25.52,12.74 25.08,12.74 24.77,12.38 C7.2
N$11
  Top 0.406: PAGE_DETECTION.2 60.64,26.67 59.69,27.62 58.25,27.62 Q3.3
N$12
  Top 0.254: Q1.1 20.02,20.94 20.32,20.64 20.32,20.32 20,20 20,19.84 D1.1 19.68,17.46 19.98,17.16 21.59,17.16 | TMC5130.33 21.59,17.16 | C2.2 21.59,17.16
N$13  (via drill 0.3)
  Top 0.254: TMC5130.9 39.39,19.66 40.01,19.05 40.01,17.46 40.32,17.14 45.4,17.14 v46.04,17.78
  Bottom 0.254: v46.04,17.78 46.04,24.77 46.99,25.72 REFR/STEP.2
N$14
  Top 0.254: REFL/STEP.2 46.83,16.67 40.16,16.67 39.53,17.3 39.53,18.73 39.1,19.16 TMC5130.8
N$15
  Top 0.406: REF_SWITCH.3 60.64,15.24 59.37,13.97 59.37,11.43 59.05,11.11 58.42,11.11 | 58.42,11.11 56.52,11.11 | 56.52,11.11 R8.1 | LED2.C 58.42,11.11 | R4.2 53.66,12.38 54.92,11.12 56.52,11.12 56.52,11.11
N$16
  Top 0.406: REF_SWITCH.1 59.69,20.32 59.37,20.64 59.37,21.91 59.05,22.23 58.42,22.23 | 58.42,22.23 56.52,22.23 R6.1 55.88,23.18 R3.2 | LED1.C 58.42,22.23
N$17
  Top 0.406: LED2.A 58.1,15.56 R12.1
N$18
  Top 0.406: LED1.A 58.1,17.78 R13.1
N$19
  Top 0.406: R14.2 C16.1 56.2,35.24 54.93,36.51 IC1.2
N$20
  Top 0.406: IC1.3 JP7.1
N$21
  Top 0.406: PAGE_DETECTION.3 60.01,29.21 59.05,30.16 R14.1
N$22
  Top 0.406: R9.1 63.82,34.1 63.82,25.4 62.55,24.13 PAGE_DETECTION.1
N$23
  Bottom 1.016: 22.54,13.97 23.5,14.92
N$24
  Top 0.254: 30.16,24.13 30.16,24.77
REF_L  (via drill 0.3)
  Top 0.254: 53.55,15.56 R4.1
  Top 0.406: 52.07,15.56 REFL/STEP.3 | C3.2 52.07,15.56 | SV1.16 27.46,52.46 27.46,50.48 29.53,48.42 v29.53,42.55 | 52.07,15.56 53.55,15.56
  Bottom 0.254: v29.53,42.55 37.47,42.55 38.42,41.59 38.42,19.37 37.78,18.73 37.78,17.46 40.64,14.61 42.23,14.61 43.18,15.56 REFL/STEP.3
REF_R  (via drill 0.3)
  Top 0.254: SV1.37 54.09,50.05 56.83,47.31 v56.83,40.64
  Top 0.406: R3.1 52.39,23.5 | 52.39,23.5 48.58,23.5 REFR/STEP.3 | C6.2 52.39,23.5
  Bottom 0.254: v56.83,40.64 56.83,28.57 51.44,23.18 REFR/STEP.3
SCANNER_1_ENABLE
  Top 0.406: SCANNER_ENABLE.1 60.64,38.1 60.01,37.47 R10.2 58.1,37.47 57.47,37.47 55.88,39.05 55.88,46.99 52.86,50.01 52.86,52.86 53.77,53.77 SV1.38
SCANNER_2_ENABLE
  Top 0.406: SV1.40 56.31,53.77 55.4,52.86 55.4,50.01 58.42,46.99 R11.2 60.01,43.81 60.64,43.18 SCANNER_ENABLE.3
SENSE1
  Top 0.254: TMC5130.44 32.18,12.18 32.07,12.06
  Top 0.61: 32.07,12.06 32.07,9.53 32.96,9.53 R5.2
  Top 1.016: SENSE1.1 33.08,9.53 R5.2 | D6.A 42.23,12.06 42.86,11.43 SENSE1.1 | D5.A 42.23,6.99 42.86,7.62 SENSE1.1
SENSE2
  Top 0.254: 32.18,23.93 TMC5130.17
  Top 0.61: R7.2 32.18,30.42 32.18,23.93
  Top 1.016: R7.2 34.23,30.54 SENSE2.1 39.37,31.75 40.32,30.8 40.32,28.28 D3.A D4.A
SPI_CLK  (via drill 0.3)
  Top 0.254: TMC5130.4 36.49,17.16 37.78,15.88 37.78,15.56 38.1,15.24 39.69,15.24 40.64,16.19 41.59,16.19 v41.91,15.88
  Top 0.406: IC1.7 v41.59,36.51 39.05,36.51 38.42,37.15 38.42,47.94 36.31,50.05 SV1.23
  Bottom 0.254: v41.59,36.51 41.59,16.19 v41.91,15.88
STEP  (via drill 0.3)
  Top 0.406: SV1.12 22.38,52.46 22.38,50.01 22.86,49.53 26.67,49.53 28.57,47.62 v28.57,43.5 | REFL/STEP.1 46.67,20.64 45.72,21.59 45.72,28.89 v45.09,29.53
  Bottom 0.406: v28.57,43.5 43.81,43.5 45.09,42.23 v45.09,29.53

### Text on the board
tNames: Motorcontroller V0.5